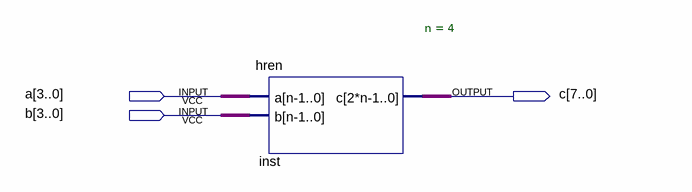
[diagram p0: schematic sheet]
// Quartus schematic OA2.bdf as structural Verilog: 1 symbols, 3 pins
module OA2 (
  input  [3:0] a,
  input  [3:0] b,
  output [7:0] c
);

  hren #(.n(4)) inst (.a(a), .b(b), .c(c));
endmodule
